# EAGLE design KeyPadv2 (EAGLE 9.1.0)

## Sheet 1 of 3
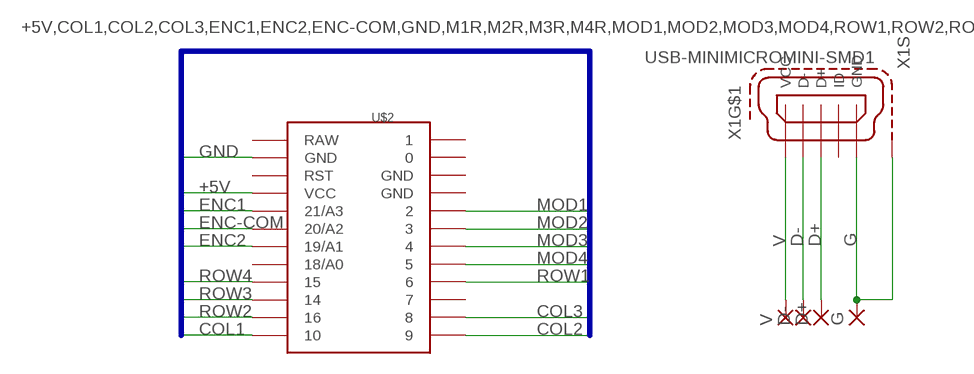
[diagram p0: schematic, sheet 1]

### Parts
D+  SMD2  [SMD1,27-2,54]
D-  SMD2  [SMD1,27-2,54]
G  SMD2  [SMD1,27-2,54]
U$2  PROMICRO  [PROMICRO]
V  SMD2  [SMD1,27-2,54]
X1  USB-MINIMICROMINI-SMD1  [32005-201]

### Nets
+5V: U$2.VCC
COL1: U$2.10 ; also sheet 2,3
COL2: U$2.9 ; also sheet 2,3
COL3: U$2.8 ; also sheet 2,3
D+: D+.1(P) X1.3(D+)
D-: D-.1(P) X1.2(D-)
ENC1: U$2.21/A3 ; also sheet 2,3
ENC2: U$2.19/A1 ; also sheet 2,3
ENC-COM: U$2.20/A2 ; also sheet 2
G: G.1(P) X1.5(GND) X1.M1(S:S1) X1.M2(S:S1) X1.M3(S:S1) X1.M4(S:S1)
GND: U$2.GND@1(GND) ; also sheet 3
MOD1: U$2.2 ; also sheet 3
MOD2: U$2.3 ; also sheet 3
MOD3: U$2.4 ; also sheet 3
MOD4: U$2.5 ; also sheet 3
ROW1: U$2.6 ; also sheet 2
ROW2: U$2.16 ; also sheet 2
ROW3: U$2.14 ; also sheet 2
ROW4: U$2.15 ; also sheet 2
V: V.1(P) X1.1(VCC)
Unconnected: U$2.7 U$2.18/A0 U$2.GND@3(GND) U$2.RST X1.4(ID)

### Buses
+5V,COL1,COL2,COL3,ENC1,ENC2,ENC-COM,GND,M1R,M2R,M3R,M4R,MOD1,MOD2,MOD3,MOD4,ROW1,ROW2,ROW3,ROW4

## Sheet 2 of 3
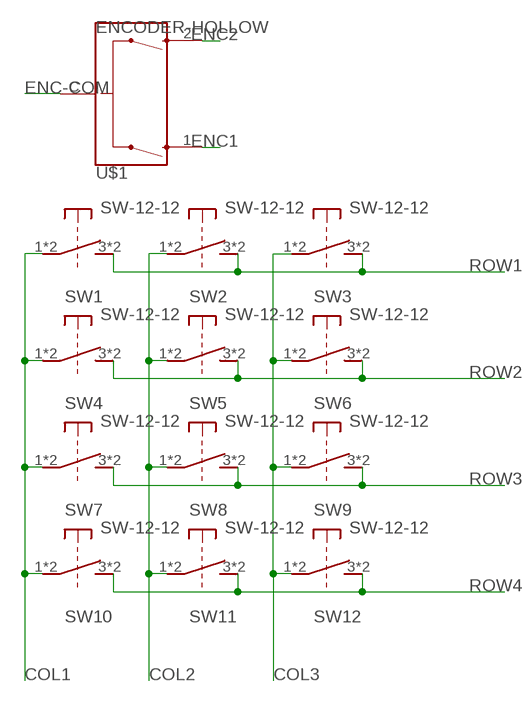
[diagram p1: schematic, sheet 2]

### Parts
SW1  SW-12-12  [B3F-40XX]
SW2  SW-12-12  [B3F-40XX]
SW3  SW-12-12  [B3F-40XX]
SW4  SW-12-12  [B3F-40XX]
SW5  SW-12-12  [B3F-40XX]
SW6  SW-12-12  [B3F-40XX]
SW7  SW-12-12  [B3F-40XX]
SW8  SW-12-12  [B3F-40XX]
SW9  SW-12-12  [B3F-40XX]
SW10  SW-12-12  [B3F-40XX]
SW11  SW-12-12  [B3F-40XX]
SW12  SW-12-12  [B3F-40XX]
U$1  ENCODER-HOLLOW  [HOLLOW-ENCODER]

### Nets
COL1: SW1.1 SW1.2 SW4.1 SW4.2 SW7.1 SW7.2 SW10.1 SW10.2 ; also sheet 1,3
COL2: SW2.1 SW2.2 SW5.1 SW5.2 SW8.1 SW8.2 SW11.1 SW11.2 ; also sheet 1,3
COL3: SW3.1 SW3.2 SW6.1 SW6.2 SW9.1 SW9.2 SW12.1 SW12.2 ; also sheet 1,3
ENC1: U$1.1(A) ; also sheet 1,3
ENC2: U$1.2(B) ; also sheet 1,3
ENC-COM: U$1.C ; also sheet 1
ROW1: SW1.3 SW1.4 SW2.3 SW2.4 SW3.3 SW3.4 ; also sheet 1
ROW2: SW4.3 SW4.4 SW5.3 SW5.4 SW6.3 SW6.4 ; also sheet 1
ROW3: SW7.3 SW7.4 SW8.3 SW8.4 SW9.3 SW9.4 ; also sheet 1
ROW4: SW10.3 SW10.4 SW11.3 SW11.4 SW12.3 SW12.4 ; also sheet 1

## Sheet 3 of 3
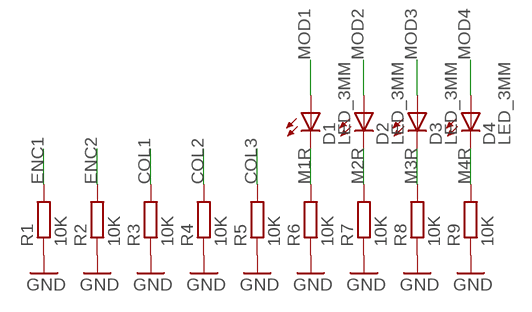
[diagram p2: schematic, sheet 3]

### Parts
D1  LED_3MM  [LED3MM]
D2  LED_3MM  [LED3MM]
D3  LED_3MM  [LED3MM]
D4  LED_3MM  [LED3MM]
R1  10K  R_R1206  [RESC3216X60]
R2  10K  R_R1206  [RESC3216X60]
R3  10K  R_R1206  [RESC3216X60]
R4  10K  R_R1206  [RESC3216X60]
R5  10K  R_R1206  [RESC3216X60]
R6  10K  R_R1206  [RESC3216X60]
R7  10K  R_R1206  [RESC3216X60]
R8  10K  R_R1206  [RESC3216X60]
R9  10K  R_R1206  [RESC3216X60]

### Nets
COL1: R3.2 ; also sheet 1,2
COL2: R4.2 ; also sheet 1,2
COL3: R5.2 ; also sheet 1,2
ENC1: R1.2 ; also sheet 1,2
ENC2: R2.2 ; also sheet 1,2
GND: R1.1 R2.1 R3.1 R4.1 R5.1 R6.1 R7.1 R8.1 R9.1 ; also sheet 1
M1R: D1.K(C) R6.2
M2R: D2.K(C) R7.2
M3R: D3.K(C) R8.2
M4R: D4.K(C) R9.2
MOD1: D1.A ; also sheet 1
MOD2: D2.A ; also sheet 1
MOD3: D3.A ; also sheet 1
MOD4: D4.A ; also sheet 1

## Power pins joined to a net without a drawn wire
0: U$2.0
1: U$2.1
GND: U$2.GND@2(GND)
RAW: U$2.RAW

## Library data of the parts
D1-D4 = Flamberm:LED_
D+ D- G V = wirepad:SMD2: SMD PAD
R1-R9 = Flamberm:R_
SW1-SW12 = Flamberm:SW-12-12
U$1 = Flamberm:ENCODER-HOLLOW
U$2 = Flamberm:PROMICRO
X1 = Flamberm:USB-MINIMICRO: MINI USB-B Conector Source: www.cypressindustries.com; OC_FARNELL: unknown; OC_NEWARK: unknown

## Board
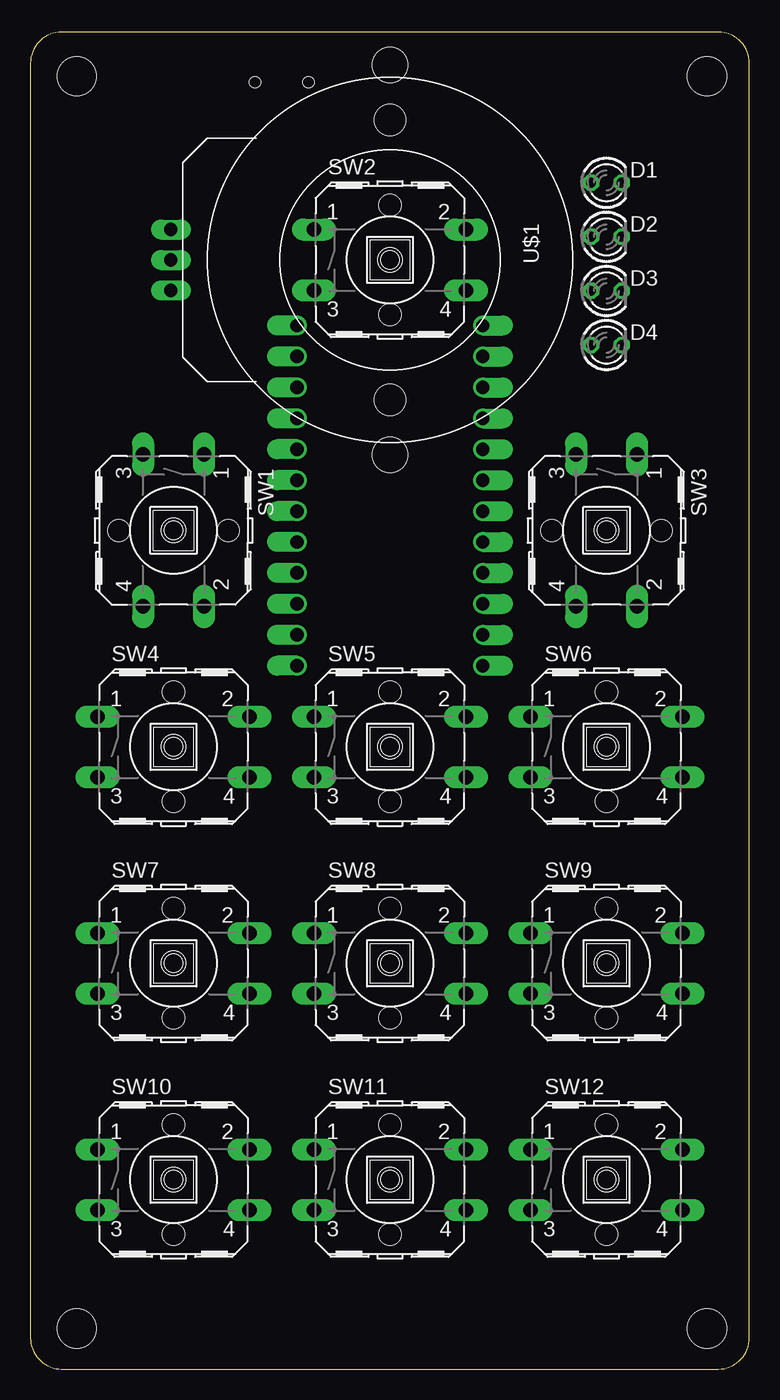
[diagram p3: board, top side]
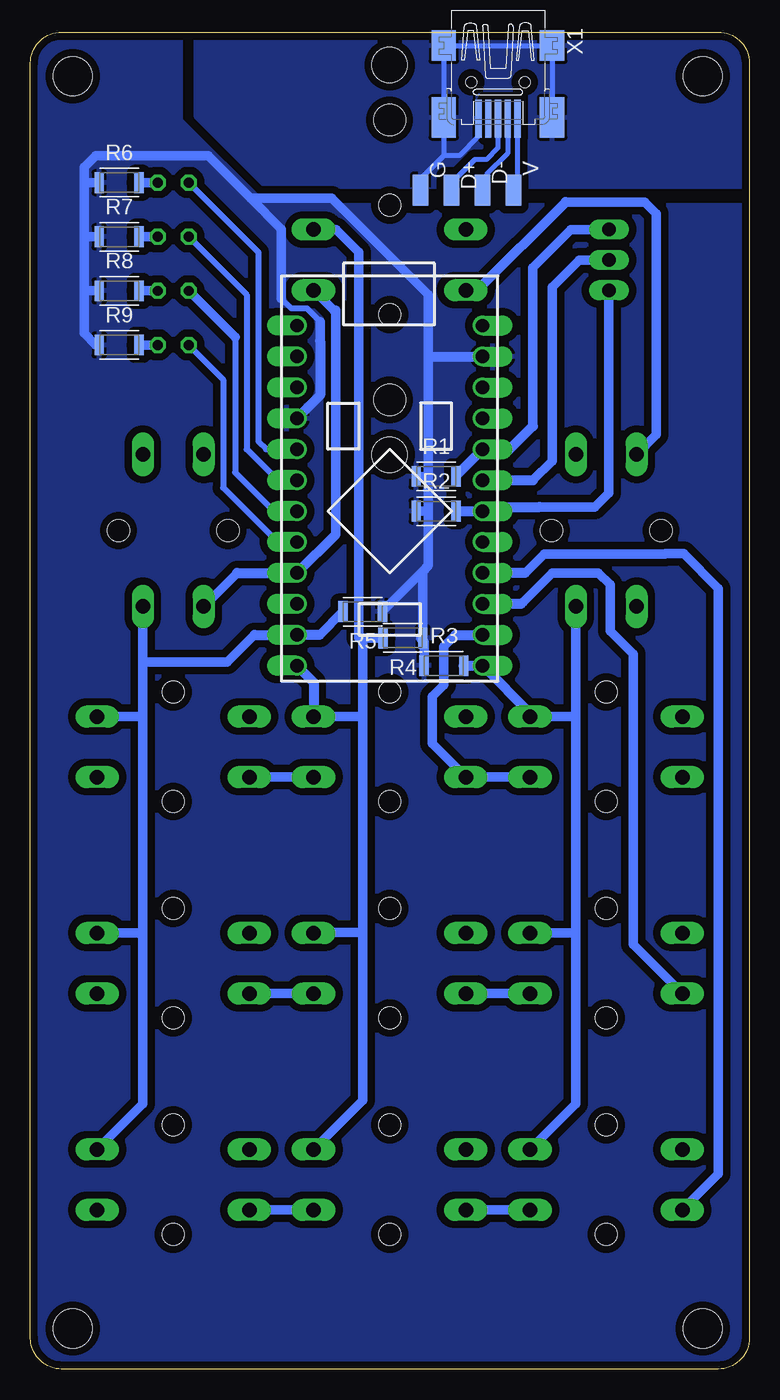
[diagram p4: board, bottom side, seen from below]

Size 59.03 x 109.84 mm. Coordinates in mm from the lower left corner, seen from the top.
Outline: 59.03,2.54 59.03,107.3 arc90 56.49,109.84 2.54,109.84 arc90 0,107.3 0,2.54 arc90 2.54,0 56.49,0 arc90 59.03,2.54
Copper layers (1*16): Top 0.035mm / dielectric 1.5mm / Bottom 0.035mm
Design rules "EagleDesignRules": minimum track width 0.25mm, minimum drill 0.3mm, track to track 0.25mm, track to pad 0.25mm, pad to pad 0.25mm, via to via 0.25mm, smd to smd 0.25mm, copper to edge 0.5mm, drill to drill 0.5mm, minimum pad ring 10mil, minimum via ring 8mil, stop-mask expansion 4mil, vias tented up to drill 0mil, thermal gap 0.25mm
Holes 3.2 mm at 3.81,3.33 55.56,3.33 3.81,106.2 55.56,106.2

### Footprints (pad centres in the part's own frame; a part is rotated, then mirrored left to right if it is on the bottom)
LED3MM = drill 0.813 octagon: A -1.27,0; K 1.27,0
SMD1,27-2,54 = smd 1.27 x 2.54: 1 0,0
RESC3216X60 = smd 0.762 x 1.712: 1 -1.625,0; 2 1.625,0
B3F-40XX = drill 1.194 long: 1 -6.248,2.489; 2 6.248,2.489; 3 -6.248,-2.489; 4 6.248,-2.489 | hole 1.803: 0,-4.496; 0,4.496
HOLLOW-ENCODER = drill 1.1 long: 1 -2.5,-18; 2 2.5,-18; C 0,-18 | hole 2.6: -11.5,0; 11.5,0 | hole 2.9: -16,0; 16,0
PROMICRO = drill 1.1 offset: 0 -7.62,10.16; 1 -7.62,12.7; 2 -7.62,2.54; 3 -7.62,0; 4 -7.62,-2.54; 5 -7.62,-5.08; 6 -7.62,-7.62; 7 -7.62,-10.16; 8 -7.62,-12.7; 9 -7.62,-15.24; 10 7.62,-15.24; 14 7.62,-10.16; 15 7.62,-7.62; 16 7.62,-12.7; 18/A0 7.62,-5.08; 19/A1 7.62,-2.54; 20/A2 7.62,0; 21/A3 7.62,2.54; GND@1 7.62,10.16; GND@2 -7.62,5.08; GND@3 -7.62,7.62; RAW 7.62,12.7; RST 7.62,7.62; VCC 7.62,5.08
32005-201 = smd 3.1 x 0.5: 1 3,1.6; 2 3,0.8; 3 3,0; 4 3,-0.8; 5 3,-1.6 | smd 2.5 x 2: M1 -3,-4.45; M2 -3,4.45 | smd 3.3 x 2: M3 2.9,4.45; M4 2.9,-4.45 | hole 0.9: 0,2.2; 0,-2.2

### Placement (x,y rotation side)
D1  47.31,97.47 0 top
D2  47.31,93.03 0 top
D3  47.31,88.58 0 top
D4  47.31,84.14 0 top
D+  24.45,96.84 180 bottom
D-  21.91,96.84 180 bottom
G  26.99,96.84 180 bottom
R1  25.72,73.34 0 bottom
R2  25.72,70.48 0 bottom
R3  25.08,57.79 0 bottom
R4  28.45,60.07 180 bottom
R5  31.75,62.23 180 bottom
R6  51.75,97.47 0 bottom
R7  51.75,93.03 0 bottom
R8  51.75,88.58 0 bottom
R9  51.75,84.14 0 bottom
SW1  11.75,68.9 270 top
SW2  29.53,91.12 0 top
SW3  47.31,68.9 270 top
SW4  11.75,51.12 0 top
SW5  29.53,51.12 0 top
SW6  47.31,51.12 0 top
SW7  11.75,33.34 0 top
SW8  29.53,33.34 0 top
SW9  47.31,33.34 0 top
SW10  11.75,15.56 0 top
SW11  29.53,15.56 0 top
SW12  47.31,15.56 0 top
U$1  29.53,91.12 270 top
U$2  29.53,73.02 0 bottom
V  19.37,96.84 180 bottom
X1  20.64,105.73 270 bottom

### Tracks (layer width: path | path; a pad name or v marks a point on that pad's centre or on a via)
COL1
  Bottom 0.8: SW1.2 14.24,57.79 14.24,53.66 | 14.24,53.66 14.24,35.88 | 14.24,35.88 14.24,21.81 SW10.2 | SW7.2 14.29,35.83 14.24,35.88 | SW4.2 14.29,53.61 14.24,53.66
  Bottom 0.813: R3.2 U$2.10 18,53.87 SW4.2
COL2
  Bottom 0.8: SW11.2 31.75,22.07 31.75,35.88 | 31.75,35.88 35.73,35.88 SW8.2 | 31.75,35.88 31.75,53.66 | 31.75,53.66 31.8,53.61 SW5.2 | SW2.2 33.92,93.61 32.07,91.76 32.07,60.07 31.75,60.07 | 31.75,53.66 31.75,57.79 31.75,60.01 31.75,60.07 | R4.2 31.75,60.07
  Bottom 0.813: U$2.9 35.78,56.41 SW5.2
COL3
  Bottom 0.8: SW3.2 49.8,58.1 | 49.8,58.1 49.8,53.66 | 49.8,53.66 49.8,35.56 | 49.8,35.56 49.8,21.81 SW12.2 | SW9.2 50.06,35.83 49.8,35.56 | SW6.2 49.85,53.61 49.8,53.66 | 40.64,60.33 42.86,58.1 49.8,58.1 | R5.2 35.28,60.33
  Bottom 0.813: 40.64,60.33 U$2.8 35.28,60.33
D+
  Bottom 0.406: X1.3 20.64,100.33 21.59,99.38 22.54,99.38 24.45,97.47 D+.1
D-
  Bottom 0.406: X1.2 19.84,99.86 21.59,98.11 21.59,97.16 D-.1
ENC1
  Bottom 0.8: U$1.1 14.64,93.62 17.78,90.49 17.78,77.47
  Bottom 0.813: R1.2 24.09,73.38 U$2.21/A3 19.68,75.56 17.78,77.47
ENC2
  Bottom 0.8: U$1.2 11.53,71.97 12.7,70.8 15.88,70.8 15.9,70.82 17.23,70.82 17.24,70.8
  Bottom 0.813: 17.23,70.82 21.57,70.82 U$2.19/A1 R2.2
ENC-COM
  Bottom 0.8: U$1.C 13.97,91.12 16.19,88.9 16.19,74.61 17.78,73.02
  Bottom 0.813: U$2.20/A2 17.78,73.02
G
  Bottom 0.406: X1.5 22.24,101.27 23.81,99.69 25.08,99.69 | 25.08,99.69 26.99,97.79 G.1 | 25.08,99.69 25.09,99.7 X1.M4 X1.M1 X1.M2 X1.M3
  pour Bottom (isolate 0.61): 0,97.16 39.69,97.16 45.4,102.87 45.4,109.85 1.91,109.85 0,107.95
GND
  Bottom 0.406: 26.35,76.2 26.35,76.52
  Bottom 0.508: 38.42,87.95 37.59,87.12 36.32,87.12 35.24,86.04
  Bottom 0.8: R3.1 26.71,59.73 26.99,60.01 26.99,60.07 R4.1 26.82,65.53 26.35,66 | R5.1 26.35,66 | 26.35,66 26.35,70.48 | 26.35,70.48 26.35,73.34 | 26.35,73.34 26.35,76.2 26.35,83.18 26.35,88.27 34.29,96.2 40.96,96.2 | R2.1 26.35,70.48 | R1.1 26.35,73.34 | R9.1 53.66,84.14 54.61,85.09 54.61,88.58 | 54.61,88.58 54.61,93.03 | 54.61,93.03 54.61,97.47 | 54.61,97.47 54.61,98.74 53.66,99.69 44.45,99.69 40.96,96.2 | R6.1 54.61,97.47 | R7.1 54.61,93.03 | R8.1 54.61,88.58 | 35.24,86.04 35.24,84.45 | 38.42,87.95 38.42,93.66 40.96,96.2
  Bottom 0.813: 35.24,84.45 35.24,80.01 U$2.GND@2 | 26.35,83.18 U$2.GND@1
  pour Bottom (isolate 0.61): 0,95.57 39.69,95.57 46.67,102.55 46.67,109.85 57.15,109.85 59.05,107.95 59.05,1.91 57.15,0 1.91,0 0,1.91
M1R
  Bottom 0.8: D1.K R6.2
M2R
  Bottom 0.8: D2.K R7.2
M3R
  Bottom 0.8: D3.K R8.2
M4R
  Bottom 0.8: D4.K R9.2
MOD1
  Bottom 0.508: D1.A 40.32,91.76 40.32,76.2 39.69,75.56 U$2.2
MOD2
  Bottom 0.508: D2.A 41.27,88.27 41.27,75.56 38.73,73.02 U$2.3
MOD3
  Bottom 0.508: 42.23,84.77 42.23,73.66 39.05,70.48 U$2.4
  Bottom 0.8: 42.23,84.77 D3.A
MOD4
  Bottom 0.508: D4.A 43.2,81.3 43.2,72.41 38.73,67.94 U$2.5
ROW1
  Bottom 0.8: SW3.4 42.06,65.41 | SW2.4 34.14,86.99 33.97,86.99 33.97,68.58 | 15.07,95.88 8.57,95.88 7.62,94.93 7.62,76.78 SW1.3
  Bottom 0.813: 42.06,65.41 U$2.6 33.97,68.58 | 15.07,95.88 22.33,88.63 SW2.3
ROW2
  Bottom 0.8: SW4.4 SW5.3 26.04,51.38 26.04,55.25 25.08,56.2 25.08,59.37 24.13,60.33 | SW5.4 SW6.3
  Bottom 0.813: 24.13,60.33 U$2.16
ROW3
  Bottom 0.8: SW7.4 SW8.3 | SW8.4 SW9.3 | SW7.3 9.53,34.87 9.53,55.88 9.53,58.74 11.43,60.64 11.43,64.45 12.38,65.41 16.19,65.41 18.57,63.02 18.73,62.87
  Bottom 0.813: 18.73,62.87 U$2.14
ROW4
  Bottom 0.8: SW10.4 SW11.3 | SW11.4 SW12.3 | SW10.3 2.54,16.03 2.54,64.13 5.4,66.99 6.89,66.99 6.9,66.97 16.84,66.97 18.41,65.41
  Bottom 0.813: 18.41,65.41 U$2.15
V
  Bottom 0.406: X1.1 19.04,97.17 V.1